# EAGLE design attiny85_bo (EAGLE 6.4)
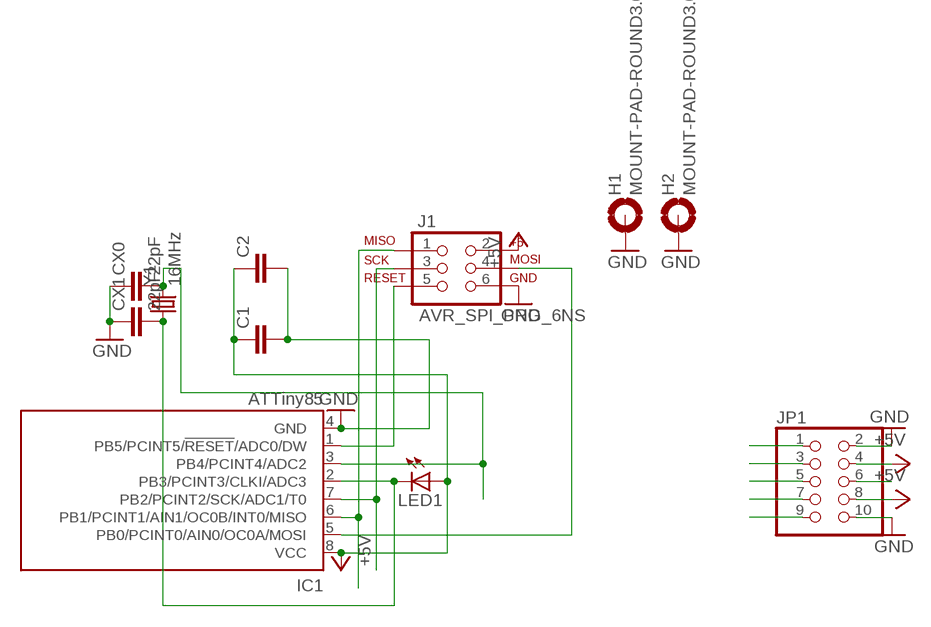
[diagram p0: schematic, sheet 1]

## Parts
C1  C-EUC0805  [C0805]
C2  C-EUC0805  [C0805]
CX0  22pF  C-EUC0603  [C0603]
CX1  22pF  C-EUC0603  [C0603]
H1  MOUNT-PAD-ROUND3.0  [3,0-PAD]
H2  MOUNT-PAD-ROUND3.0  [3,0-PAD]
IC1  ATTiny85  TINY13-20SU  [8S2]
J1  AVR_SPI_PRG_6NS  [2X3-NS]
JP1  PINHD-2X5  [2X05]
LED1  LED0603  [LED-0603]
Y1  16MHz  CRYSTAL5X3  [CRYSTAL-SMD-5X3]

## Nets
+5V [POWER]: C1.1 C2.1 IC1.8(VCC) J1.2 JP1.4 JP1.8 LED1.A
GND [POWER]: C1.2 C2.2 CX0.1 CX1.1 H1.B3,0(MOUNT) H2.B3,0(MOUNT) IC1.4(GND) J1.6 JP1.2 JP1.10
PB0: IC1.5(PB0/PCINT0/AIN0/OC0A/MOSI) J1.4 JP1.1
PB1: IC1.6(PB1/PCINT1/AIN1/OC0B/INT0/MISO) J1.1 JP1.3
PB2: IC1.7(PB2/PCINT2/SCK/ADC1/T0) J1.3 JP1.5
PB3: CX1.2 IC1.2(PB3/PCINT3/CLKI/ADC3) JP1.7 LED1.C Y1.1
PB4: CX0.2 IC1.3(PB4/PCINT4/ADC2) JP1.9 Y1.3
PB5: IC1.1(PB5/PCINT5/!RESET!/ADC0/DW) J1.5 JP1.6

## Library data of the parts
C1 C2 CX0 CX1 = rcl:C-EU: CAPACITOR, European symbol
H1 H2 = holes:MOUNT-PAD-ROUND: MOUNTING PAD, round
IC1 = atmel:TINY13: 8-bit AVR Microcontroller with 1K Bytes In-System Programmable Flash Source: http://www.atmel.com/dyn/resources/prod_documents/2535S.pdf; MPN: ATTINY13-20SU; OC_FARNELL: 9171568; OC_NEWARK: 96K6522
J1 = SparkFun-Connectors:AVR_SPI_PRG_6: AVR ISP 6 Pin This is the reduced ISP connector for AVR programming. Common on Arduino. This footprint will take up less PCB space and can be used with a 10-pin to 6-pin adapter such as SKU: BOB-08508
JP1 = pinhead:PINHD-2X5: PIN HEADER
LED1 = SparkFun-LED:LED: LEDs Standard schematic elements and footprints for 5mm, 3mm, 1206, and 0603 sized LEDs. 5mm - Spark Fun Electronics SKU : COM-00529 (and others)
Y1 = SparkFun-FreqCtrl:CRYSTAL: Various standard crystals. Proven footprints. Spark Fun Electronics SKU : COM-00534

## Net classes
1 POWER: width 0.254 mm

## Board
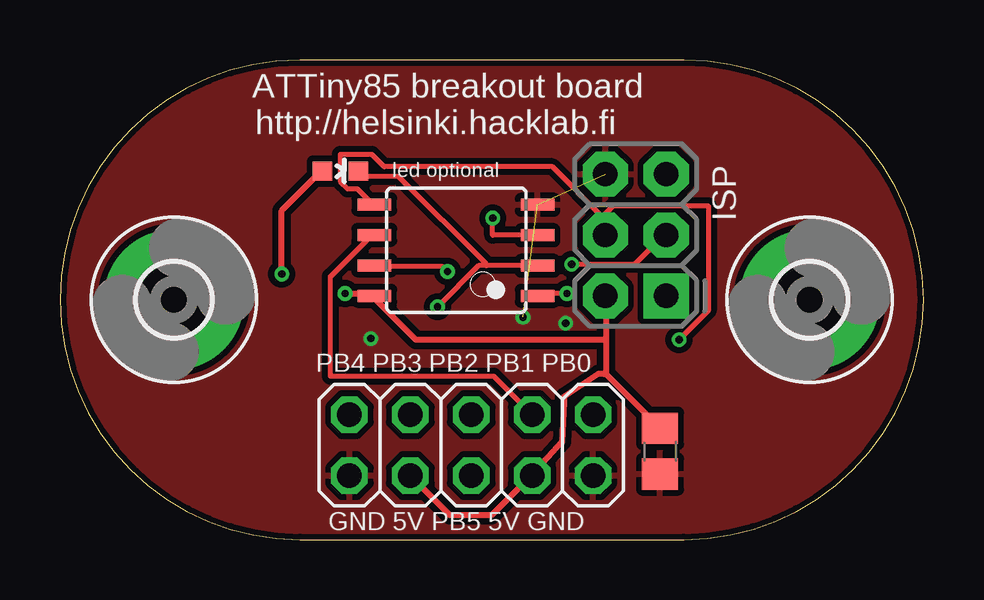
[diagram p1: board, top side]
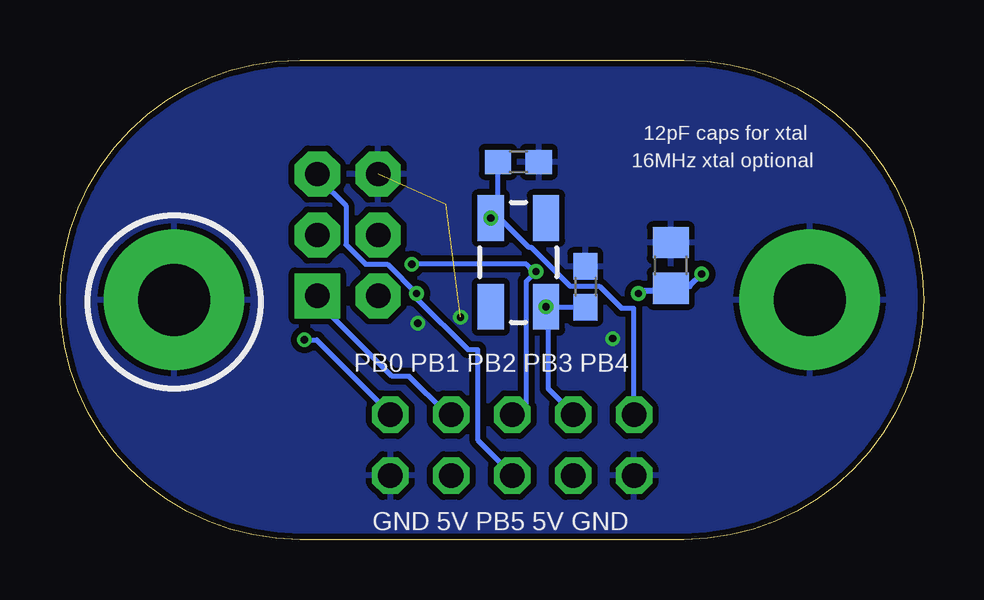
[diagram p2: board, bottom side, seen from below]

Size 36 x 20 mm. Coordinates in mm from the lower left corner, seen from the top.
Outline: 10,20 arc180 10,0 26,0 arc180 26,20 10,20
Copper layers (1*16): Top 0.035mm / dielectric 1.5mm / Bottom 0.035mm
Design rules "default": minimum track width 8mil, minimum drill 12mil, track to track 6mil, track to pad 6mil, pad to pad 6mil, via to via 6mil, smd to smd 0mil, copper to edge 10mil, drill to drill 10mil, minimum pad ring 10mil, minimum via ring 6mil, stop-mask expansion 2mil, vias tented up to drill 100mil, thermal gap 10mil

### Footprints (pad centres in the part's own frame; a part is rotated, then mirrored left to right if it is on the bottom)
C0805 = smd 1.3 x 1.5: 1 -0.95,0; 2 0.95,0
C0603 = smd 1.1 x 1: 1 -0.85,0; 2 0.85,0
3,0-PAD = drill 3 pad 5.842: B3,0 0,0
8S2 = smd 0.5 x 1.4: 1 -1.905,-3.404; 2 -0.645,-3.404; 3 0.625,-3.404; 4 1.895,-3.404; 5 1.905,3.404; 6 0.635,3.404; 7 -0.635,3.404; 8 -1.905,3.404
2X3-NS = drill 1.016 pad 1.88 square: 1 -2.54,-1.27 | drill 1.016 pad 1.88 octagon: 2 -2.54,1.27; 3 0,-1.27; 4 0,1.27; 5 2.54,-1.27; 6 2.54,1.27
2X05 = drill 1.016 octagon: 1 -5.08,-1.27; 2 -5.08,1.27; 3 -2.54,-1.27; 4 -2.54,1.27; 5 0,-1.27; 6 0,1.27; 7 2.54,-1.27; 8 2.54,1.27; 9 5.08,-1.27; 10 5.08,1.27
LED-0603 = smd 0.8 x 0.8: A 0,-0.75; C 0,0.75
CRYSTAL-SMD-5X3 = smd 1.9 x 1.1: 1 -1.85,-1.15; 2 1.85,-1.15; 3 1.85,1.15; 4 -1.85,1.15

### Placement (x,y rotation side)
C1  10.54,11.43 90 bottom
C2  25.02,3.68 270 top
CX0  16.89,15.75 180 bottom
CX1  14.1,10.54 270 bottom
H1  4.75,10 0 top
H2  31.25,10 0 top
IC1  16.51,12.06 90 top
J1  24,12.7 90 top
JP1  17.14,3.94 180 top
LED1  11.68,15.37 270 top
Y1  16.89,11.56 90 bottom

### Tracks (layer width: path | path; a pad name or v marks a point on that pad's centre or on a via)
+5V  (via drill 0.3)
  Top 0.254: JP1.8 14.63,2.64 16.26,1.02 17.98,1.02 19.61,2.64 JP1.4 19.71,2.74 20.93,4.06 21.01,5.71 21.01,5.94 22.45,6.91 22.66,6.91 22.76,6.91 | v9.25,11.07 9.25,13.72 10.87,15.34 LED1.A | v11.89,10.26 12.9,10.26 13.01,10.16 IC1.8 13.11,10.06 14.83,8.33 22.66,8.33 22.76,8.33 | 22.76,6.91 24.99,4.67 C2.1 | 22.76,8.33 22.76,10.16 J1.2 | 22.76,8.33 22.76,6.91
  Bottom 0.254: v9.25,11.07 9.75,10.57 10.46,10.57 C1.1 10.57,10.36 11.79,10.36 v11.89,10.26
GND  (via drill 0.3)  (2 unrouted)
  other vias: 12.95,8.38 21.08,9.02 19.3,9.27
  pour Top (isolate 0.254): 0,19.94 0,0 35.81,0 35.81,19.94
  pour Bottom (isolate 0.254): 0,19.94 0,0 35.81,0 35.81,19.94
PB0  (via drill 0.3)
  Top 0.203: IC1.5 13.01,14.02 12.39,14.63 11.99,14.63 11.68,14.94 11.68,16.05 13.01,16.05 13.51,15.54 20.52,15.54 22.66,13.41 22.66,12.7 J1.4 22.66,13.51 23.06,13.92 27.03,13.92 27.03,9.55 v25.81,8.33
  Bottom 0.203: v25.81,8.33 25.3,8.33 22.25,5.28 JP1.1
PB1
  Top 0.203: IC1.6 13.01,12.7 11.28,10.97 11.28,6.81 18.09,6.81 19.61,5.28 JP1.3
  Bottom 0.203: J1.1 25.2,10.16 25.2,9.35 24.69,9.35 22.15,6.81 21.44,6.81 19.91,5.28 19.71,5.28 JP1.3
PB2  (via drill 0.3)
  Top 0.203: v16.15,11.18 15.95,11.38 13.11,11.38 IC1.7 | v21.34,11.48 23.98,11.48 25.2,12.7 J1.3
  Bottom 0.203: JP1.5 17.07,5.28 16.56,5.28 16.56,10.77 v16.15,11.18 16.26,11.18 16.56,11.48 v21.34,11.48
PB3  (via drill 0.3)
  Top 0.203: IC1.2 17.78,11.42 | 17.78,11.42 17.45,11.42 Y1.1 | LED1.C 12.5,15.34 12.7,15.14 14.12,15.14 17.78,11.48 17.78,11.42
  Bottom 0.203: CX1.2 14.11,9.71 Y1.1 15.65,9.65 15.65,6.3 14.63,5.28 JP1.7
  other vias: 15.74,9.71
PB4  (via drill 0.3)
  Top 0.203: IC1.3 18.04,12.69 Y1.3
  Bottom 0.203: CX0.2 17.74,13.41 Y1.3 17.78,13.31 17.58,13.31 16.46,12.19 16.36,12.19 14.73,10.57 13.51,10.57 12.6,9.65 12.09,9.65 12.09,5.28 JP1.9
  other vias: 18.04,13.41
PB5  (via drill 0.3)
  Top 0.203: v21.13,10.26 20.12,10.26 20.02,10.16 IC1.1
  Bottom 0.203: J1.5 25.2,15.24 25.2,15.04 24.08,13.92 24.08,12.29 23.27,11.48 22.35,11.48 v21.13,10.26 21.13,10.06 19,7.92 18.59,7.92 18.59,4.17 17.17,2.74 JP1.6

### Text on the board
tNames: ATTiny85 breakout board | http://helsinki.hacklab.fi | ISP | led optional | PB4 PB3 PB2 PB1 PB0 | GND 5V PB5 5V GND
bNames: 12pF caps for xtal | 16MHz xtal optional | PB0 PB1 PB2 PB3 PB4 | GND 5V PB5 5V GND